# EAGLE design geigerzaehler_board (EAGLE 6.5.0)
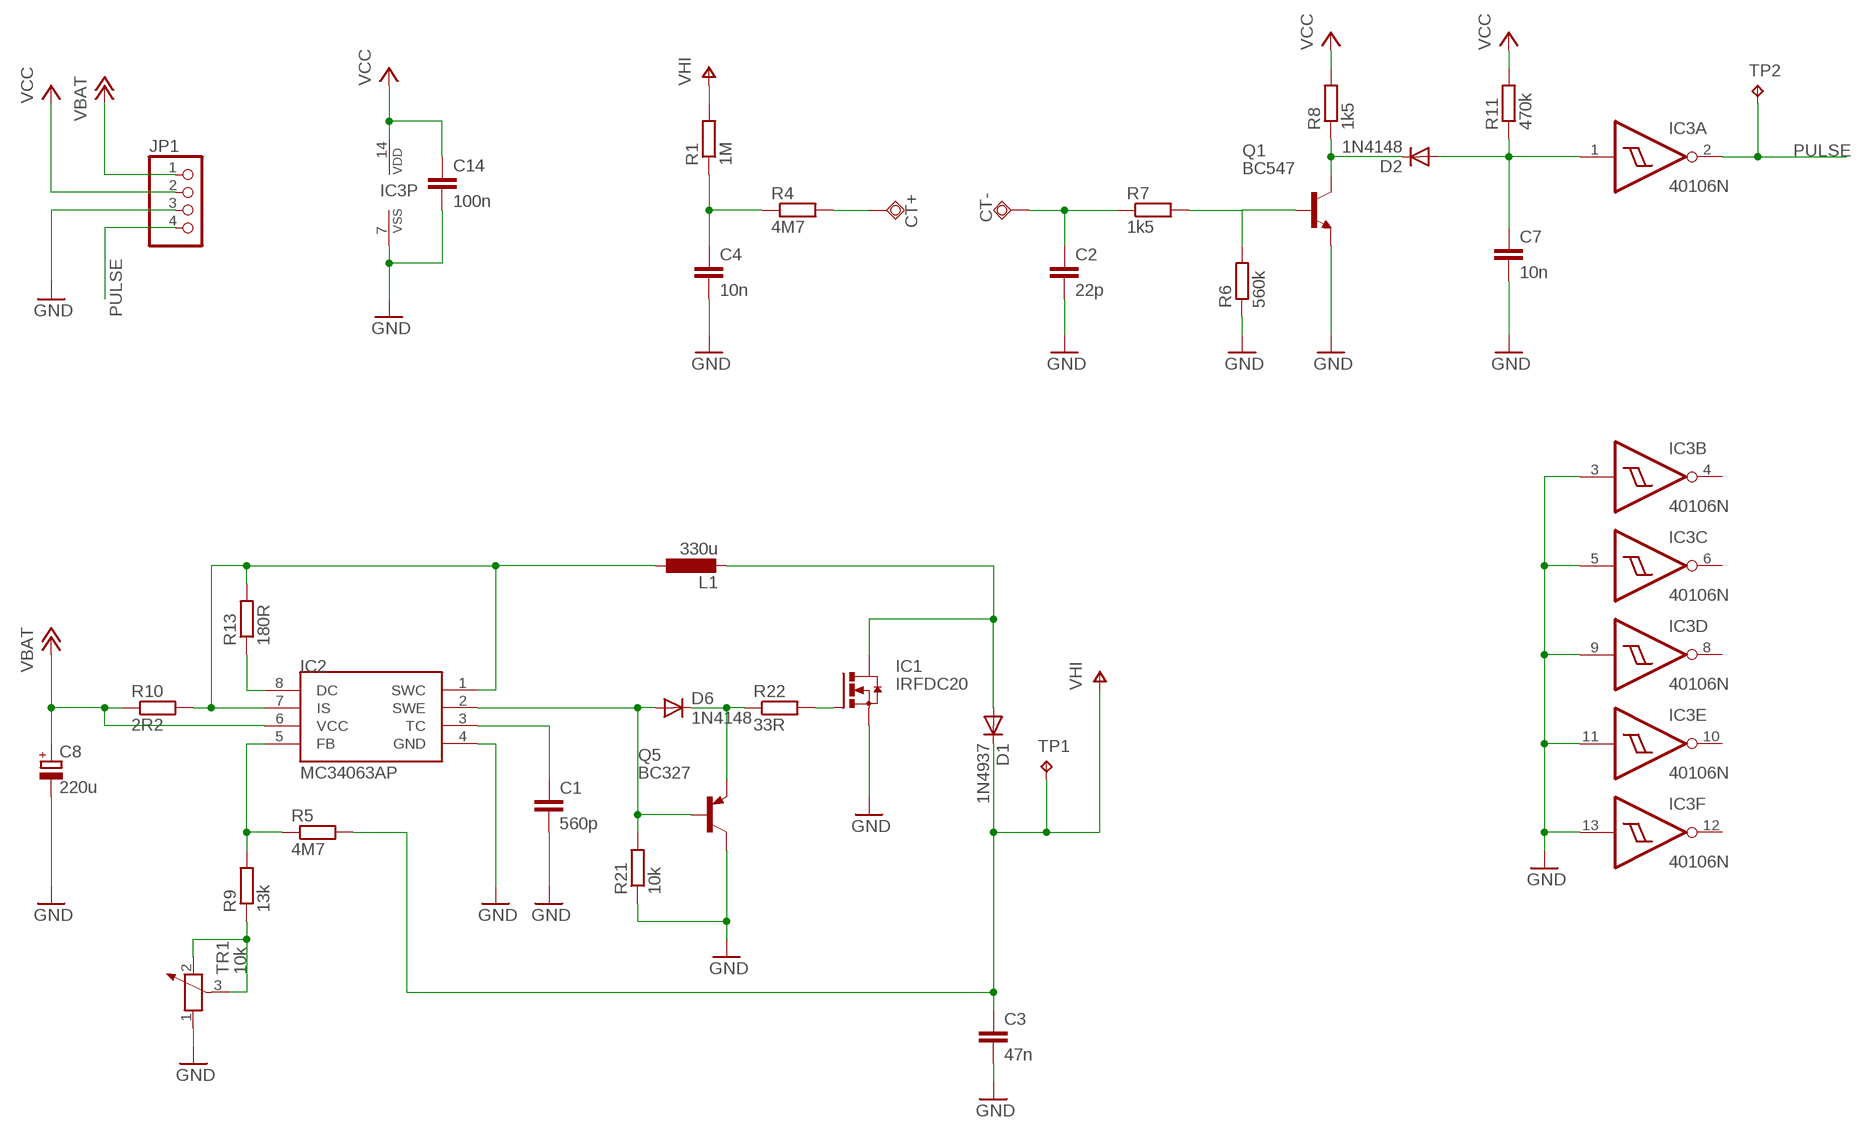
[diagram p0: schematic, sheet 1]

## Parts
C1  560p  C-EU025-025X050  [C025-025X050]
C2  22p  C-EU025-025X050  [C025-025X050]
C3  47n  C-EU075-052X106  [C075-052X106]
C4  10n  C-EU075-032X103  [C075-032X103]
C7  10n  C-EU050-025X075  [C050-025X075]
C8  220u  CPOL-EUE3.5-8  [E3,5-8]
C14  100n  C-EU050-025X075  [C050-025X075]
CT+  TPSQPAD1-13Y  [P1-13Y]
CT-  TPSQPAD1-13Y  [P1-13Y]
D1  1N4937  1N4933  [DO41-10]
D2  1N4148  1N4148DO35-10  [DO35-10]
D6  1N4148  1N4148DO35-7  [DO35-7]
IC1  IRFDC20  [DIL04]
IC2  MC34063AP  [DIL08]
IC3  40106N  [DIL14]
JP1  PINHD-1X4  [1X04]
L1  330u  L-EU5-8  [L-EU5-8]
Q1  BC547  [TO92]
Q5  BC327  [TO92]
R1  1M  R-EU_0207/10  [0207/10]
R4  4M7  R-EU_0207/10  [0207/10]
R5  4M7  R-EU_0207/10  [0207/10]
R6  560k  R-EU_0207/10  [0207/10]
R7  1k5  R-EU_0207/10  [0207/10]
R8  1k5  R-EU_0207/10  [0207/10]
R9  13k  R-EU_0207/10  [0207/10]
R10  2R2  R-EU_0309/12  [0309/12]
R11  470k  R-EU_0207/10  [0207/10]
R13  180R  R-EU_0207/10  [0207/10]
R21  10k  R-EU_0207/10  [0207/10]
R22  33R  R-EU_0207/10  [0207/10]
TP1  TPPAD1-13Y  [P1-13Y]
TP2  TPPAD1-13Y  [P1-13Y]
TR1  10k  POTENTIOMETER_PT_SPIN  [PT-SPIN]

## Nets
GND: C1.2 C2.2 C3.2 C4.2 C7.2 C8.- C14.2 IC1.4(S) IC2.4(GND) IC3.3(B:I) IC3.5(C:I) IC3.7(P:VSS) IC3.9(D:I) IC3.11(E:I) IC3.13(F:I) JP1.3 Q1.1(E) Q5.3(C) R6.1 R21.1 TR1.1
N$1: D6.A IC2.2(SWE) Q5.2(B) R21.2
N$2: D6.C Q5.1(E) R22.1
N$3: IC1.3(G) R22.2
N$4: D1.A IC1.1(D) L1.P$3
N$5: IC2.5(FB) R5.1 R9.2
N$6: C1.1 IC2.3(TC)
N$7: IC2.8(DC) R13.1
N$8: IC2.1(SWC) IC2.7(IS) L1.P$1 R10.2 R13.2
N$9: R9.1 TR1.2 TR1.3
N$11: C4.1 R1.1 R4.1
N$12: CT+.TP R4.2
N$13: C2.1 CT-.TP R7.1
N$14: Q1.2(B) R6.2 R7.2
N$15: D2.C Q1.3(C) R8.1
N$16: C7.1 D2.A IC3.1(A:I) R11.1
PULSE: IC3.2(A:O) JP1.4 TP2.TP
VBAT: C8.+ IC2.6(VCC) JP1.1 R10.1
VCC: C14.1 IC3.14(P:VDD) JP1.2 R8.2 R11.2
VHIGH: C3.1 D1.C R1.2 R5.2 TP1.TP ; supply symbol labelled VHI
Unconnected: IC3.4(B:O) IC3.6(C:O) IC3.8(D:O) IC3.10(E:O) IC3.12(F:O)

## Library data of the parts
C1-C4 C7 C14 = rcl:C-EU: CAPACITOR, European symbol
C8 = rcl:CPOL-EU: POLARIZED CAPACITOR, European symbol
CT+ CT- = testpad:TPSQ: Test pad
D1 = diode:1N4933: DIODE fast recovery rectifier, 1A
D2 D6 = diode:1N4148: DIODE high speed (Philips)
IC1 = m3space:IRFDC20
IC2 = mc34063:MC34063
IC3 = 40xx:40106: Hex SCHMITT TRIGGER
JP1 = pinhead:PINHD-1X4: PIN HEADER
L1 = m3space:L-EU5-8
Q1 = transistor:BC547: NPN TRANSISTOR
Q5 = transistor-pnp:BC327: PNP Transistor
R1 R4-R11 R13 R21 R22 = rcl:R-EU_: RESISTOR, European symbol
TP1 TP2 = testpad:TP: Test pad
TR1 = rcl:POTENTIOMETER_: Potentiometer

## Board
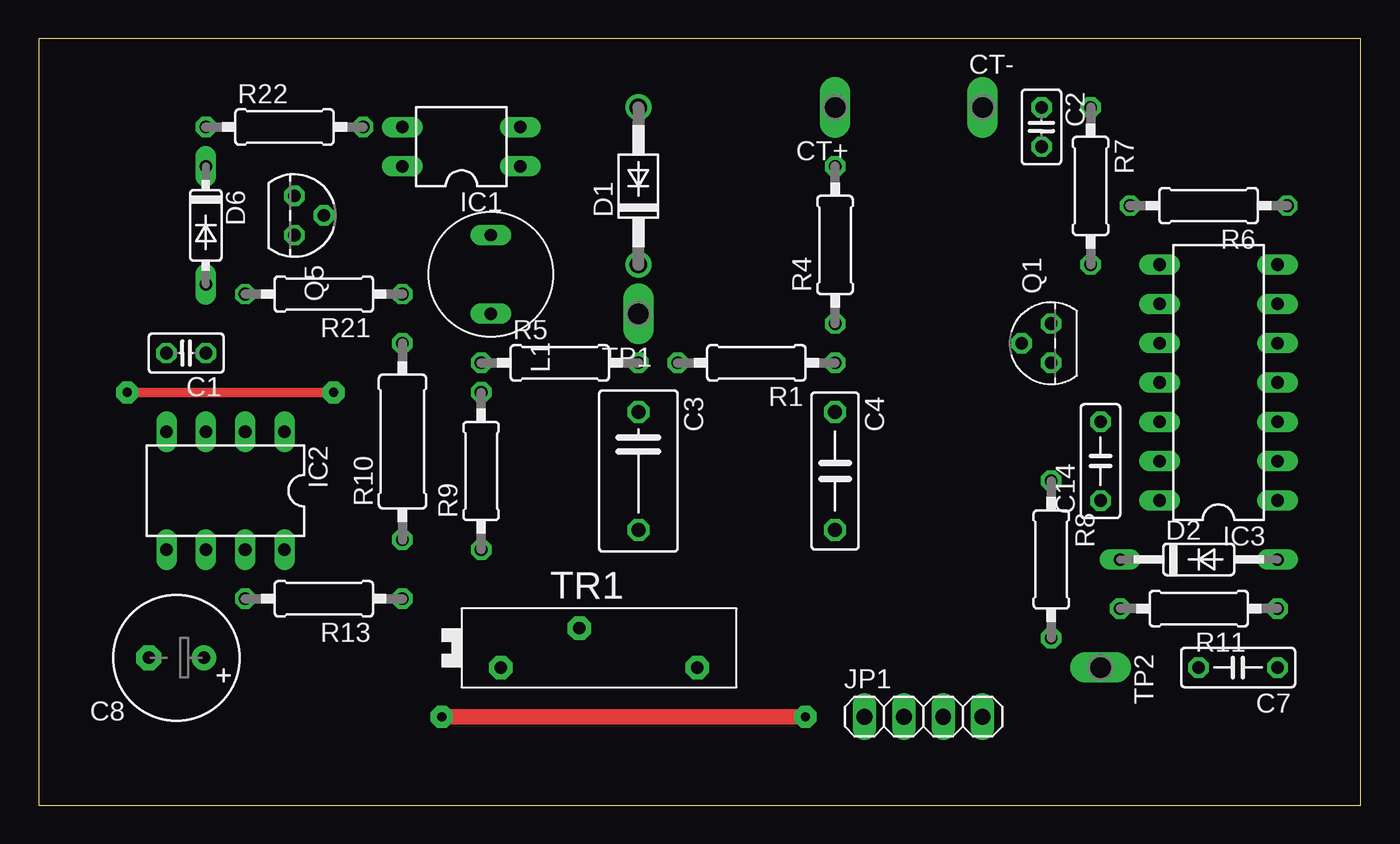
[diagram p1: board, top side]
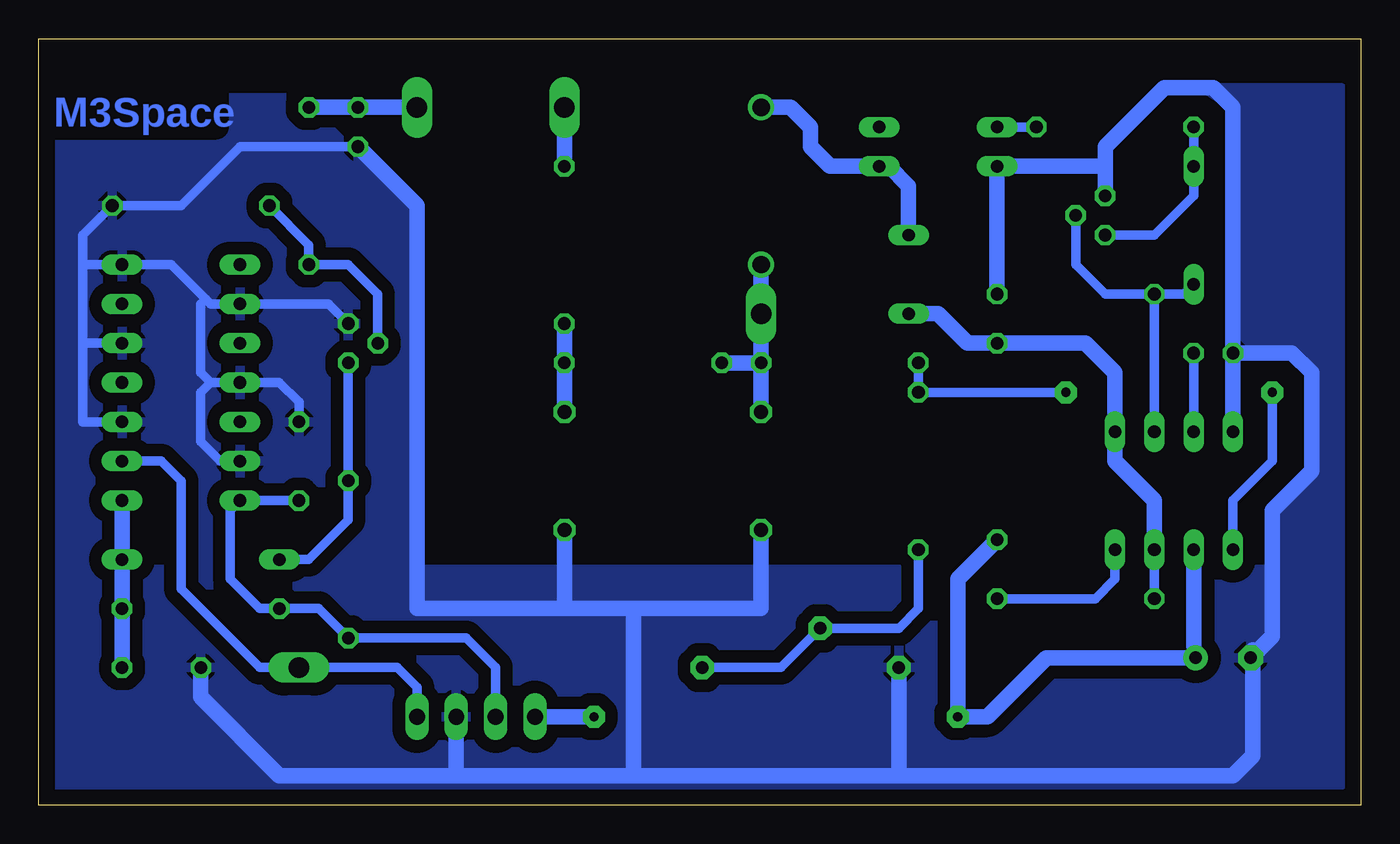
[diagram p2: board, bottom side, seen from below]

Size 85.39 x 49.52 mm. Coordinates in mm from the lower left corner, seen from the top.
Outline: 0,0 85.39,0 85.39,49.52 0,49.52 0,0
Copper layers (1*16): Top 0.035mm / dielectric 1.5mm / Bottom 0.035mm
Design rules "default": minimum track width 10mil, minimum drill 24mil, track to track 8mil, track to pad 8mil, pad to pad 8mil, via to via 8mil, smd to smd 8mil, copper to edge 40mil, drill to drill 8mil, minimum pad ring 10mil, minimum via ring 8mil, stop-mask expansion 4mil, vias tented up to drill 0mil, thermal gap 10mil

### Footprints (pad centres in the part's own frame; a part is rotated, then mirrored left to right if it is on the bottom)
C025-025X050 = drill 0.813 octagon: 1 -1.27,0; 2 1.27,0
C075-052X106 = drill 0.914 octagon: 1 -3.81,0; 2 3.81,0
C075-032X103 = drill 0.914 octagon: 1 -3.81,0; 2 3.81,0
C050-025X075 = drill 0.813 octagon: 1 -2.54,0; 2 2.54,0
E3,5-8 = drill 0.813 pad 1.6: + -1.778,0 | drill 0.813 pad 1.6 octagon: - 1.778,0
P1-13Y = drill 1.321 pad 1.905 long: TP 0,0
DO41-10 = drill 1.118: A 5.08,0; C -5.08,0
DO35-10 = drill 0.813 long: A 5.08,0; C -5.08,0
DO35-7 = drill 0.813 long: A 3.81,0; C -3.81,0
DIL04 = drill 0.813 long: 1 -1.27,-3.81; 2 1.27,-3.81; 3 1.27,3.81; 4 -1.27,3.81
DIL08 = drill 0.813 long: 1 -3.81,-3.81; 2 -1.27,-3.81; 3 1.27,-3.81; 4 3.81,-3.81; 5 3.81,3.81; 6 1.27,3.81; 7 -1.27,3.81; 8 -3.81,3.81
DIL14 = drill 0.813 long: 1 -7.62,-3.81; 2 -5.08,-3.81; 3 -2.54,-3.81; 4 0,-3.81; 5 2.54,-3.81; 6 5.08,-3.81; 7 7.62,-3.81; 8 7.62,3.81; 9 5.08,3.81; 10 2.54,3.81; 11 0,3.81; 12 -2.54,3.81; 13 -5.08,3.81; 14 -7.62,3.81
1X04 = drill 1.016 long: 1 -3.81,0; 2 -1.27,0; 3 1.27,0; 4 3.81,0
L-EU5-8 = drill 0.8 long: P$1 -2.54,0; P$3 2.54,0
TO92 = drill 0.813 octagon: 1 1.27,0; 2 0,1.905; 3 -1.27,0
0207/10 = drill 0.813 octagon: 1 -5.08,0; 2 5.08,0
0309/12 = drill 0.813 octagon: 1 -6.35,0; 2 6.35,0
PT-SPIN = drill 0.813 pad 1.524 octagon: 1 -6.35,-1.27; 2 6.35,-1.27; 3 -1.27,1.27

### Placement (x,y rotation side)
C1  9.53,29.21 180 top
C2  64.77,43.81 270 top
C3  38.73,21.59 270 top
C4  51.44,21.59 270 top
C7  77.47,8.89 180 top
C8  8.89,9.53 180 top
C14  68.58,22.23 90 top
CT+  51.44,45.09 180 top
CT-  60.96,45.09 0 top
D1  38.73,40.01 90 top
D2  74.93,15.88 0 top
D6  10.79,37.47 270 top
IC1  27.3,42.55 90 top
IC2  12.06,20.32 180 top
IC3  76.2,27.3 90 top
JP1  57.15,5.71 0 top
L1  29.21,34.29 90 top
Q1  65.41,29.84 90 top
Q5  16.51,38.1 270 top
R1  46.35,28.57 180 top
R4  51.44,36.2 90 top
R5  33.66,28.57 0 top
R6  75.56,38.73 180 top
R7  67.94,40.01 270 top
R8  65.41,15.88 270 top
R9  28.57,21.59 90 top
R10  23.5,23.5 90 top
R11  74.93,12.7 180 top
R13  18.41,13.34 180 top
R21  18.41,33.02 180 top
R22  15.88,43.81 0 top
TP1  38.73,31.75 180 top
TP2  68.58,8.89 270 top
TR1  36.2,10.16 0 top

### Tracks (layer width: path | path; a pad name or v marks a point on that pad's centre or on a via)
GND
  Bottom 0.61: 74.61,32.7 74.3,32.38 IC3.9 66.67,32.38 Q1.1 | 74.61,32.7 76.83,34.92 IC3.7 82.55,34.92 | 82.55,34.92 82.55,29.84 | 82.55,29.84 82.55,24.77 IC3.3 | IC3.5 82.55,29.84 | 74.3,27.3 IC3.11 69.85,27.3 68.58,26.04 C14.2 | 74.3,27.3 74.93,27.94 74.93,32.38 74.61,32.7 | IC3.13 73.66,22.23 74.93,23.5 74.93,26.67 74.3,27.3 | C2.2 72.39,42.55 76.2,38.73 R6.1 82.55,36.83 82.55,34.92
  Bottom 1.016: R21.1 IC1.4 16.51,41.27 | 16.51,41.27 Q5.3 | IC2.4 C1.2 | C1.2 8.26,45.09 9.53,46.35 12.7,46.35 16.51,42.55 16.51,41.27 | C1.2 4.45,29.21 3.17,27.94 3.17,21.59 5.71,19.05 5.71,10.92 C8.- 6.99,10.03 6.99,3.17 8.26,1.91 29.84,1.91 | 58.42,1.91 JP1.3 | C4.2 51.44,12.7 | 51.44,12.7 46.99,12.7 | 46.99,12.7 38.73,12.7 C3.2 | 51.44,12.7 60.96,12.7 60.96,38.73 C2.2 | 58.42,1.91 46.99,1.91 | C7.2 74.93,6.99 69.85,1.91 58.42,1.91 | 46.99,1.91 46.99,12.7 | 46.99,1.91 29.84,1.91 | TR1.1 29.84,1.91
  pour Bottom (isolate 0.813): 1.27,15.24 84.45,15.24 84.45,1.27 1.27,1.27
  pour Bottom (isolate 0.813): 5.71,13.97 5.71,19.05 3.17,21.59 3.17,27.94 4.45,29.21 8.26,29.21 8.26,45.09 10.16,46.35 1.27,46.35 1.27,14.61 1.91,13.97
  pour Bottom (isolate 0.813): 84.45,13.34 84.45,45.72 68.58,45.72 61.59,38.73 61.59,13.34
N$1
  Bottom 0.61: IC2.2 R21.2 | Q5.2 18.41,34.92 16.51,33.02 R21.2 | R21.2 11.43,33.02 D6.A
N$2
  Bottom 0.61: R22.1 D6.C 10.79,39.37 13.34,36.83 Q5.1
N$3
  Bottom 0.61: R22.2 IC1.3
N$4
  Bottom 1.016: L1.P$3 29.21,40.01 30.48,41.27 IC1.1 34.29,41.27 35.56,42.55 35.56,43.81 36.83,45.09 D1.A
N$5  (via drill 0.6 pad 1.42)
  Top 0.61: v5.71,26.67 v19.05,26.67
  Bottom 0.61: IC2.5 8.26,19.68 5.71,22.23 v5.71,26.67 | v19.05,26.67 R9.2 R5.1
N$6
  Bottom 0.61: IC2.3 C1.1
N$7
  Bottom 0.61: IC2.8 15.88,14.61 17.14,13.34 R13.1
N$8
  Bottom 0.61: IC2.7 R13.2
  Bottom 1.016: IC2.7 13.34,19.68 15.88,22.23 IC2.1 15.88,27.94 17.78,29.84 R10.2 25.4,29.84 27.3,31.75 L1.P$1
N$9
  Bottom 0.61: R9.1 28.57,12.7 29.84,11.43 TR1.3 37.47,8.89 TR1.2
N$11
  Bottom 1.016: R4.1 R1.1 C4.1
N$12
  Bottom 1.016: CT+.TP R4.2
N$13
  Bottom 1.016: CT-.TP C2.1 R7.1
N$14
  Bottom 0.61: Q1.2 63.5,33.02 65.41,34.92 R7.2 67.94,36.2 R6.2
N$15
  Bottom 0.61: D2.C 67.94,15.88 65.41,18.41 R8.1 Q1.3
N$16
  Bottom 1.016: IC3.1 D2.A R11.1 C7.1
PULSE
  Bottom 0.61: IC3.2 77.47,22.23 76.2,20.95 76.2,13.97 71.12,8.89 TP2.TP 62.23,8.89 60.96,7.62 JP1.4
VBAT  (via drill 0.6 pad 1.42)
  Top 1.016: v49.53,5.71 v26.04,5.71
  Bottom 1.016: IC2.6 10.79,10.29 C8.+ 20.32,9.53 24.13,5.71 v26.04,5.71 26.04,14.61 R10.1 | JP1.1 v49.53,5.71
VCC
  Bottom 0.61: JP1.2 55.88,8.89 57.78,10.79 R8.2 67.31,12.7 R11.2 71.12,12.7 73.03,14.61 73.03,19.05 IC3.14 C14.1
VHIGH
  Bottom 1.016: C3.1 R5.2 | R1.2 R5.2 | D1.C TP1.TP R5.2

### Text on the board
Bottom: M3Space